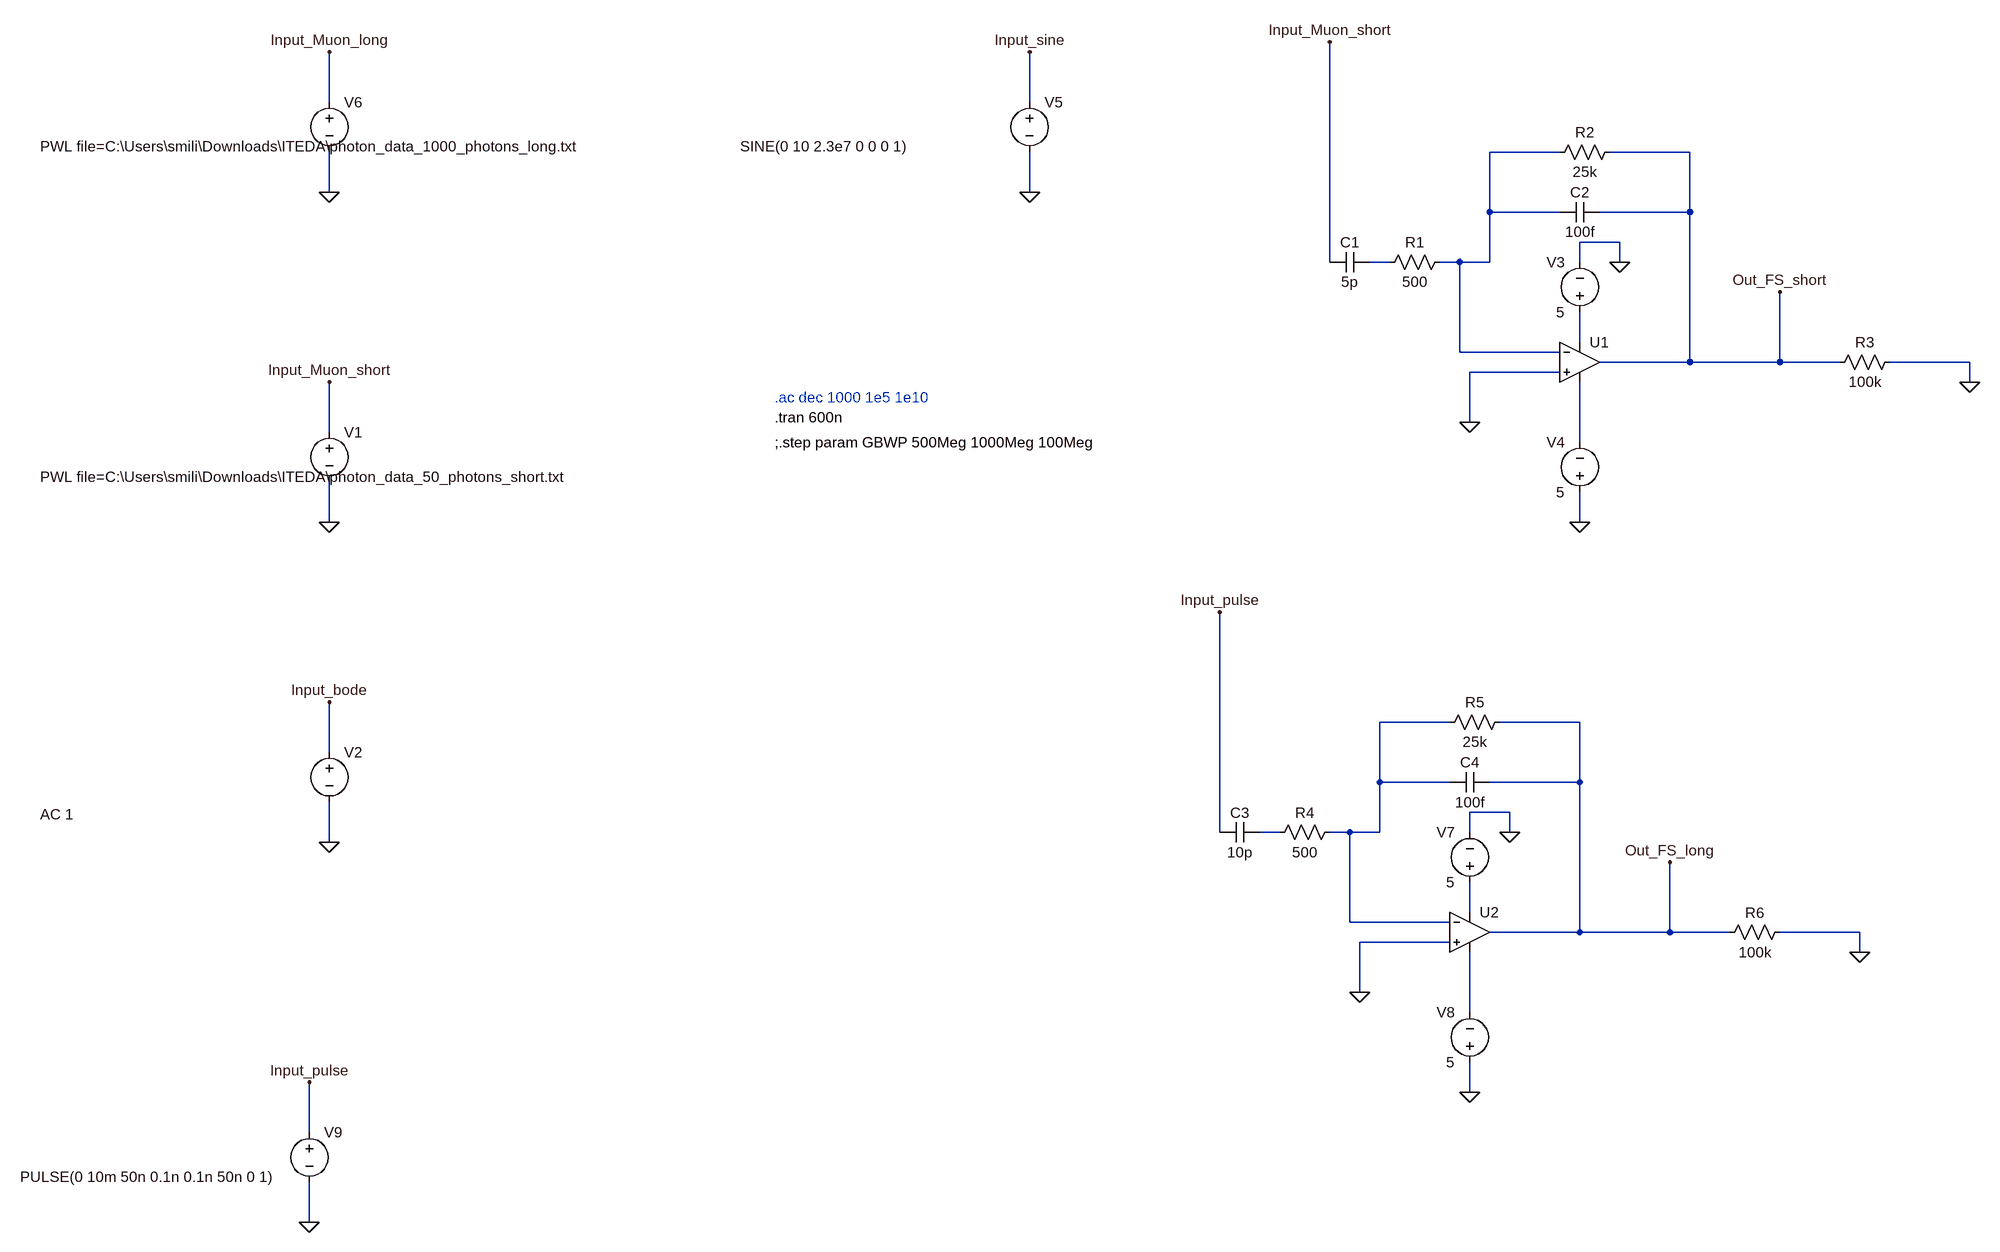
[diagram p0: schematic fast-shaper-v4.asc]
fast-shaper-v4.asc, the LTspice schematic file:
Version 4
SHEET 1 2516 1220
WIRE -1376 -592 -1376 -672
WIRE -256 -592 -256 -672
WIRE 592 -512 480 -512
WIRE 800 -512 672 -512
WIRE -1376 -448 -1376 -512
WIRE -256 -448 -256 -512
WIRE 480 -416 480 -512
WIRE 592 -416 480 -416
WIRE 800 -416 800 -512
WIRE 800 -416 656 -416
WIRE 688 -368 624 -368
WIRE 224 -336 224 -688
WIRE 320 -336 288 -336
WIRE 432 -336 400 -336
WIRE 480 -336 480 -416
WIRE 480 -336 432 -336
WIRE 624 -336 624 -368
WIRE 688 -336 688 -368
WIRE 624 -208 624 -256
WIRE 432 -192 432 -336
WIRE 592 -192 432 -192
WIRE 800 -176 800 -416
WIRE 800 -176 656 -176
WIRE 944 -176 944 -288
WIRE 944 -176 800 -176
WIRE 1040 -176 944 -176
WIRE 1248 -176 1120 -176
WIRE 592 -160 448 -160
WIRE 1248 -144 1248 -176
WIRE 448 -80 448 -160
WIRE -1376 -64 -1376 -144
WIRE 624 -48 624 -144
WIRE -1376 80 -1376 16
WIRE 624 80 624 32
WIRE 416 400 304 400
WIRE 624 400 496 400
WIRE -1376 448 -1376 368
WIRE 304 496 304 400
WIRE 416 496 304 496
WIRE 624 496 624 400
WIRE 624 496 480 496
WIRE 512 544 448 544
WIRE 48 576 48 224
WIRE 144 576 112 576
WIRE 256 576 224 576
WIRE 304 576 304 496
WIRE 304 576 256 576
WIRE 448 576 448 544
WIRE 512 576 512 544
WIRE -1376 592 -1376 528
WIRE 448 704 448 656
WIRE 256 720 256 576
WIRE 416 720 256 720
WIRE 624 736 624 496
WIRE 624 736 480 736
WIRE 768 736 768 624
WIRE 768 736 624 736
WIRE 864 736 768 736
WIRE 1072 736 944 736
WIRE 416 752 272 752
WIRE 1072 768 1072 736
WIRE 272 832 272 752
WIRE 448 864 448 768
WIRE 448 992 448 944
WIRE -1408 1056 -1408 976
WIRE -1408 1200 -1408 1136
FLAG -1376 80 0
FLAG -1376 -144 Input_Muon_short
FLAG 624 80 0
FLAG 688 -336 0
FLAG 448 -80 0
FLAG 944 -288 Out_FS_short
FLAG 1248 -144 0
FLAG 224 -688 Input_Muon_short
FLAG -1376 592 0
FLAG -1376 368 Input_bode
FLAG -256 -448 0
FLAG -256 -672 Input_sine
FLAG -1376 -448 0
FLAG -1376 -672 Input_Muon_long
FLAG 448 992 0
FLAG 512 576 0
FLAG 272 832 0
FLAG 768 624 Out_FS_long
FLAG 1072 768 0
FLAG 48 224 Input_pulse
FLAG -1408 1200 0
FLAG -1408 976 Input_pulse
SYMBOL voltage -1376 -80 R0
WINDOW 3 -463 87 Left 2
WINDOW 123 0 0 Left 0
WINDOW 39 0 0 Left 0
SYMATTR Value PWL file=C:\Users\smili\Downloads\ITEDA\photon_data_50_photons_short.txt
SYMATTR InstName V1
SYMBOL res 416 -352 R90
WINDOW 0 0 56 VBottom 2
WINDOW 3 32 56 VTop 2
SYMATTR InstName R1
SYMATTR Value 500
SYMBOL res 688 -528 R90
WINDOW 0 0 56 VBottom 2
WINDOW 3 32 56 VTop 2
SYMATTR InstName R2
SYMATTR Value 25k
SYMBOL voltage 624 -240 R180
WINDOW 0 24 96 Left 2
WINDOW 3 24 16 Left 2
WINDOW 123 0 0 Left 0
WINDOW 39 0 0 Left 0
SYMATTR InstName V3
SYMATTR Value 5
SYMBOL voltage 624 48 R180
WINDOW 0 24 96 Left 2
WINDOW 3 24 16 Left 2
WINDOW 123 0 0 Left 0
WINDOW 39 0 0 Left 0
SYMATTR InstName V4
SYMATTR Value 5
SYMBOL OpAmps\\UniversalOpAmp1 624 -176 R0
SYMATTR InstName U1
SYMATTR Value2 Avol=1Meg GBW={GBWP} Vos=0
SYMBOL res 1136 -192 R90
WINDOW 0 0 56 VBottom 2
WINDOW 3 32 56 VTop 2
SYMATTR InstName R3
SYMATTR Value 100k
SYMBOL cap 288 -352 R90
WINDOW 0 0 32 VBottom 2
WINDOW 3 32 32 VTop 2
SYMATTR InstName C1
SYMATTR Value 5p
SYMBOL cap 656 -432 R90
WINDOW 0 0 32 VBottom 2
WINDOW 3 32 32 VTop 2
SYMATTR InstName C2
SYMATTR Value 100f
SYMBOL voltage -1376 432 R0
WINDOW 3 -463 87 Left 2
WINDOW 123 -463 115 Left 2
WINDOW 39 0 0 Left 0
SYMATTR Value ""
SYMATTR Value2 AC 1
SYMATTR InstName V2
SYMBOL voltage -256 -608 R0
WINDOW 3 -463 87 Left 2
WINDOW 123 0 0 Left 0
WINDOW 39 0 0 Left 0
SYMATTR Value SINE(0 10 2.3e7 0 0 0 1)
SYMATTR InstName V5
SYMBOL voltage -1376 -608 R0
WINDOW 3 -463 87 Left 2
WINDOW 123 0 0 Left 0
WINDOW 39 0 0 Left 0
SYMATTR Value PWL file=C:\Users\smili\Downloads\ITEDA\photon_data_1000_photons_long.txt
SYMATTR InstName V6
SYMBOL res 240 560 R90
WINDOW 0 0 56 VBottom 2
WINDOW 3 32 56 VTop 2
SYMATTR InstName R4
SYMATTR Value 500
SYMBOL res 512 384 R90
WINDOW 0 0 56 VBottom 2
WINDOW 3 32 56 VTop 2
SYMATTR InstName R5
SYMATTR Value 25k
SYMBOL voltage 448 672 R180
WINDOW 0 24 96 Left 2
WINDOW 3 24 16 Left 2
WINDOW 123 0 0 Left 0
WINDOW 39 0 0 Left 0
SYMATTR InstName V7
SYMATTR Value 5
SYMBOL voltage 448 960 R180
WINDOW 0 24 96 Left 2
WINDOW 3 24 16 Left 2
WINDOW 123 0 0 Left 0
WINDOW 39 0 0 Left 0
SYMATTR InstName V8
SYMATTR Value 5
SYMBOL OpAmps\\UniversalOpAmp1 448 736 R0
SYMATTR InstName U2
SYMATTR Value2 Avol=1Meg GBW=800Meg Vos=0
SYMBOL res 960 720 R90
WINDOW 0 0 56 VBottom 2
WINDOW 3 32 56 VTop 2
SYMATTR InstName R6
SYMATTR Value 100k
SYMBOL cap 112 560 R90
WINDOW 0 0 32 VBottom 2
WINDOW 3 32 32 VTop 2
SYMATTR InstName C3
SYMATTR Value 10p
SYMBOL cap 480 480 R90
WINDOW 0 0 32 VBottom 2
WINDOW 3 32 32 VTop 2
SYMATTR InstName C4
SYMATTR Value 100f
SYMBOL voltage -1408 1040 R0
WINDOW 3 -463 87 Left 2
WINDOW 123 0 0 Left 0
WINDOW 39 0 0 Left 0
SYMATTR Value PULSE(0 10m 50n 0.1n 0.1n 50n 0 1)
SYMATTR InstName V9
TEXT -664 -88 Left 2 !.tran 600n
TEXT -664 -48 Left 2 !;.step param GBWP 500Meg 1000Meg 100Meg
TEXT -664 -120 Left 2 ;.ac dec 1000 1e5 1e10

The netlist it stands for:
* fast-shaper-v4.asc
V1 Input_Muon_short 0 PWL file=C:\Users\smili\Downloads\ITEDA\photon_data_50_photons_short.txt
R1 N001 N002 500
R2 Out_FS_short N001 25k
V3 N003 0 5
V4 0 N004 5
XU1 0 N001 N003 N004 Out_FS_short level1 Avol=1Meg GBW={GBWP} Vos=0 En=0 Enk=0 In=0 Ink=0 Rin=500Meg  ; pins In+ In- V+ V- OUT
R3 0 Out_FS_short 100k
C1 N002 Input_Muon_short 5p
C2 Out_FS_short N001 100f
V2 Input_bode 0 AC 1
V5 Input_sine 0 SINE(0 10 2.3e7 0 0 0 1)
V6 Input_Muon_long 0 PWL file=C:\Users\smili\Downloads\ITEDA\photon_data_1000_photons_long.txt
R4 N005 N006 500
R5 Out_FS_long N005 25k
V7 N007 0 5
V8 0 N008 5
XU2 0 N005 N007 N008 Out_FS_long level1 Avol=1Meg GBW=800Meg Vos=0 En=0 Enk=0 In=0 Ink=0 Rin=500Meg  ; pins In+ In- V+ V- OUT
R6 0 Out_FS_long 100k
C3 N006 Input_pulse 10p
C4 Out_FS_long N005 100f
V9 Input_pulse 0 PULSE(0 10m 50n 0.1n 0.1n 50n 0 1)
.tran 600n
;.step param GBWP 500Meg 1000Meg 100Meg
* .ac dec 1000 1e5 1e10
.lib UniversalOpAmp1.lib
.backanno
.end